# Altium schematic sheet Non_inverseur.SchDoc
size A4; SheetNumber: 1; SheetTotal: 1; SPICEModelCacheHDSPMVAF: <root> / <DocumentId>HDSPMVAF</DocumentId> / <CacheFrame Number="0"> / <Model Name="lmc6482a" Kind="CKT"> / <Text>*////////////////////////////////////////////////////////// / *LMC6482A CMOS Dual OP-AMP MACRO-MODEL / *////////////////////////////////////////////////////////// / * / * connections:       non-inverting input / *                    |   inverting input / *                    |   |   positive power supply / *                    |   |   |   negative power supply / *                    |   |   |   |   output / *                    |   |   |   |   | / *                    |   |   |   |   | / .SUBCKT LMC6482A     1   2  99  50  40 / * / * PINOUT ORDER +IN -IN V+ V- OUT / * / * CAUTION:  SET .OPTIONS GMIN=1E-16 TO CORRECTLY MODEL INPUT BIAS CURRENT. / * / *Features: / *Operates from single or dual supplies / *Rail-to-rail input and output swing / *Ultra low input current =             10fA / *Slew rate =                        1.2V/uS / * / *NOTE: Model is for single device only and simulated / *      supply current is 1/2 of total device current. / *      Noise is not modeled. / *      Asymmetrical gain is not modeled. / * / *****************INPUT STAGE************** / * / I1  99  4 17U / M1   5  2 4 99 MOSFET / R3   5 50 5.651K / M2   6  7 4 99 MOSFET / R4   6 50 5.651K / *Fp2=5.9 MHz / C4   5  6 2.3868P / G0  98  9 6 5 4.4165E-2 / R0  98  9 1K / DP1  1 99 DA / DP2 50  1 DB / DP3  2 99 DB / DP4 50  2 DA / *For accurate Ib , set GMIN&lt;=1E-16 on .OPTIONS line. / * / ***********COMMON MODE EFFECT*********** / * / I2  99 50 420.5U / *^Quiescent current / EOS  7  1 POLY(1) 16 49 .75E-3 1 / *Offset voltage..........^ / R8  99 49 40K / R9  49 50 40K / * / ***************POLE STAGE*************** / * / *Fp=13.3 MHz / G3  98 15 9 49 1E-3 / R12 98 15 1K / C5  98 15 11.967P / * / ************POLE/ZERO STAGE************* / * / *Fp=600 KHz, Fz= 1.4MHz / G5  98 18 15 49 1E-3 / R14 98 18 1K / R15 98 19 750 / C6  19 18 151.58P / * / *********COMMON-MODE ZERO STAGE********* / * / *Fpcm=20 KHz / G4  98 16 POLY(2) 1 49 2 49 0 2.812E-8 2.812E-8 / L2  98 17 7.958M / R13 17 16 1K / * / **************SECOND STAGE************** / * / EH  99 98 99 49 1 / G1  98 29 18 49 5.6667E-6 / R5  98 29 100.37MEG / V2  99  8 1.56 / D1  29  8 DX / D2  10 29 DX / V3  10 50 1.56 / * / **************OUTPUT STAGE************** / * / F6  99 50 VA7 1 / *^Dynamic supply current / F5  99 35 VA8 1 / D3  36 35 DX / VA7 99 36 0 / D4  35 99 DX / E1  99 37 99 49 1 / VA8 37 38 0 / G6  38 40 49 29 16.667E-3 / R16 38 40 2.3886K / V4  30 40 .77 / D5  30 99 DX / V5  40 31 .77 / D6  50 31 DX / *Fp1=2.343 Hz / C3  29 39 17P / R6  39 40 1K / * / ***************MODELS USED************** / * / .MODEL DA D(IS=2E-14) / .MODEL DB D(IS=1E-14) / .MODEL DX D(IS=1E-14) / .MODEL MOSFET PMOS(VTO=0 KP=1.842E-3) / .ENDS</Text> / </Model> / </CacheFrame> / </root>
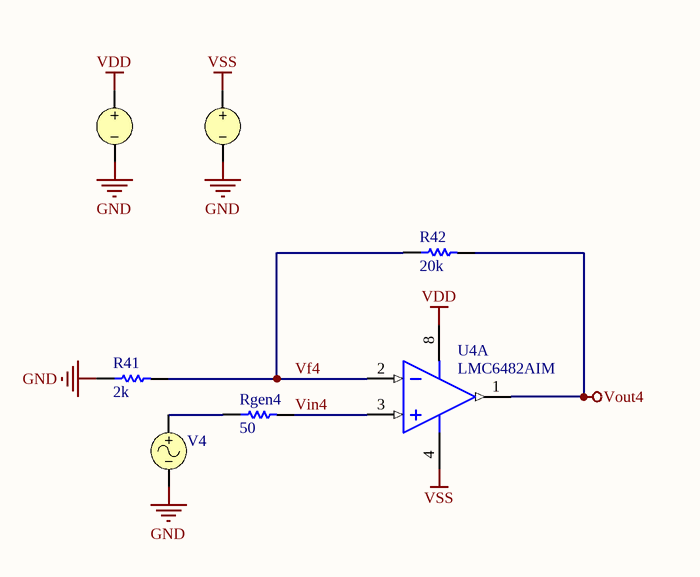
[diagram p0: Non_inverseur.SchDoc]

## Parts
R41  value 2k  (hidden comment: Resistor)
R42  value 20k  (hidden comment: Resistor)
Rgen4  value 50  (hidden comment: Resistor)
U4  LMC6482AIM  [M08A_N]  (part A of 2)
V4  SIN(0 1 10k 0 0 0)  (value not drawn)
V+?  DC 5  (value not drawn)
V-?  DC -5  (value not drawn)

## Nets
GND: R41.1 V4.2 V+?.2 V-?.2
VDD: U4.8(V+) V+?.1
Vout4: R42.2 U4.1(OUTA)
VSS: U4.4(V-) V-?.1
Vf4: R41.2 R42.1 U4.2(INA-)
Vin4: Rgen4.2 U4.3(INA+)
NetRgen4_1: Rgen4.1 V4.1

## Library data of the parts
R41 R42 Rgen4 = Resistor: TC1: 0; SimulationGenericComponent: True; TC2: 0
U4 = LMC6482AIM: CMOS Dual Rail-to-Rail Input and Output Operational Amplifier, 8-pin Narrow SOIC; Manufacturer: National Semiconductor; PackageTopMarking: NSZXTT*LMC64*82AIM; PowerWise: N; CompType: Amplifiers; Published: 4-Dec-2008; LatestRevisionDate: 13-Jan-2009; LatestRevisionNote: Sim Model Added.; DatasheetVersion: Sep-2003; PackageVersion: revM, May-2009; PackageReference: M08A; Publisher: Altium Limited; PackageDescription: SOIC Narrow, 4.9 x 3.9 x 1.45mm, 8 Lead, 1.27mm Pitch; Supplier 1: Farnell; Supplier Part Number 1: 9494723; PartNumber: LMC6482AIM; RoHS: N; PinCount: 8; Code_JEDEC: MS-012-AA; Code_IPC: SOIC127P600-8; ComponentLink1Description: LMC6482 Datasheet; ComponentLink1URL: http://www.national.com/ds/LM/LMC6482.pdf; ComponentLink2Description: LMC6482 Web Page; ComponentLink2URL: http://www.national.com/pf/LM/LMC6482.html; ComponentLink3Description: M08A Package Page; ComponentLink3URL: http://www.national.com/packaging/folders/m08a.html
V4 = VSIN: Sinusoidal Voltage Source; Note: PCB Footprint - Not required; Offset: 0; Amplitude: 1; Published: 8-Jun-2000; LatestRevisionDate: 15-Nov-2004; LatestRevisionNote: Corrected Netlist.; PackageReference: Not Applicable; Publisher: Altium Limited; Frequency: 10k; Delay: 0; Damping Factor: 0; Phase: 0; DC Magnitude: 0; AC Magnitude: 1; AC Phase: 0
V+? = VSRC: Voltage Source; Note: PCB Footprint - Not required; Value: 5; Published: 8-Jun-2000; LatestRevisionDate: 17-Jul-2002; LatestRevisionNote: Re-released for DXP Platform.; PackageReference: Not Applicable; Publisher: Altium Limited
V-? = VSRC: Voltage Source; Note: PCB Footprint - Not required; Published: 8-Jun-2000; LatestRevisionDate: 17-Jul-2002; LatestRevisionNote: Re-released for DXP Platform.; PackageReference: Not Applicable; Publisher: Altium Limited; Value: -5